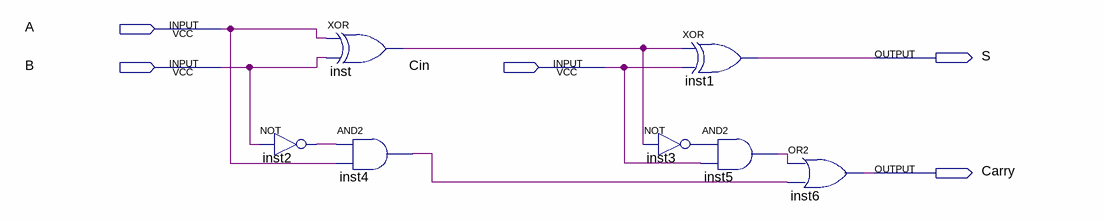
[diagram p0: schematic sheet]
// Quartus schematic Full_Swap_Subtractor.bdf as structural Verilog: 7 symbols, 5 pins
module Full_Swap_Subtractor (
  input  A,
  input  B,
  input  Cin,
  output S,
  output Carry
);

  wire inst2_out, inst3_out, inst4_out, inst5_out, inst_out;

  not inst2 (inst2_out, B);
  xor inst (inst_out, A, B);
  and inst4 (inst4_out, inst2_out, A);
  not inst3 (inst3_out, inst_out);
  xor inst1 (S, inst_out, Cin);
  and inst5 (inst5_out, inst3_out, Cin);
  or inst6 (Carry, inst5_out, inst4_out);
endmodule
